# Altium schematic sheet power-supply.SchDoc
size A4; SheetNumber: 2; SheetTotal: 6
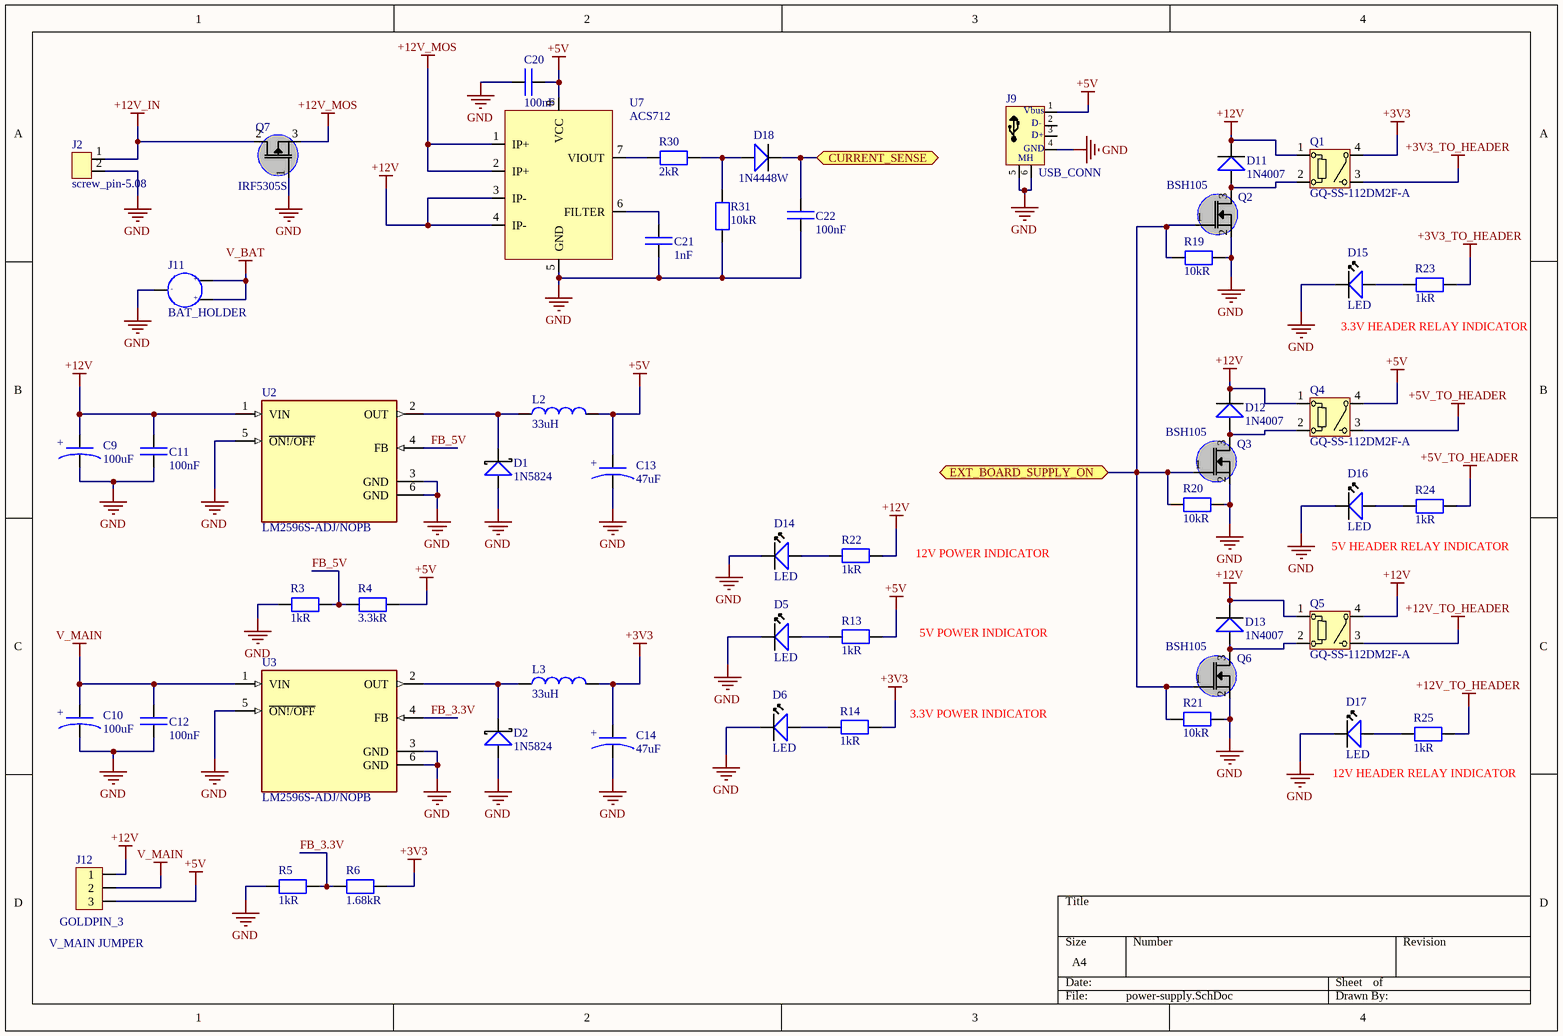
[diagram p0: power-supply.SchDoc]

## Parts
C9  100uF  [C_Pol_6.3x7.7]
C10  100uF  [C_Pol_6.3x7.7]
C11  100nF  [C0603]
C12  100nF  [C0603]
C13  47uF  [C_Pol_6.3x7.7]
C14  47uF  [C_Pol_6.3x7.7]
C20  100nF  [C0603]
C21  1nF  [C0603]
C22  100nF  [C0603]
D1  1N5824  [DO-214AA]
D2  1N5824  [DO-214AA]
D5  LED  [LED0805]
D6  LED  [LED0805]
D11  1N4007  [D_SMA]
D12  1N4007  [D_SMA]
D13  1N4007  [D_SMA]
D14  LED  [LED0805]
D15  LED  [LED0805]
D16  LED  [LED0805]
D17  LED  [LED0805]
D18  1N4448W  [SOD123F]
J2  screw_pin-5.08  [screw_pin-5.08]
J9  USB_CONN  [USB_A]
J11  BAT_HOLDER  [BAT_HOLDER]
J12  GOLDPIN_3  [PIN_HEADER_3_MALE]
L2  33uH  [SRR1260-330M]
L3  33uH  [SRR1260-330M]
Q1  GQ-SS-112DM2F-A  [GQ-SS-112DM2F-a]
Q2  BSH105  [SOT23]
Q3  BSH105  [SOT23]
Q4  GQ-SS-112DM2F-A  [GQ-SS-112DM2F-a]
Q5  GQ-SS-112DM2F-A  [GQ-SS-112DM2F-a]
Q6  BSH105  [SOT23]
Q7  IRF5305S  [DDPAK]
R3  1kR  [R0603]
R4  3.3kR  [R0603]
R5  1kR  [R0603]
R6  1.68kR  [R0603]
R13  1kR  [R0603]
R14  1kR  [R0603]
R19  10kR  [R0805]
R20  10kR  [R0805]
R21  10kR  [R0805]
R22  1kR  [R0603]
R23  1kR  [R0603]
R24  1kR  [R0603]
R25  1kR  [R0603]
R30  2kR  [R0603]
R31  10kR  [R0603]
U2  LM2596S-ADJ/NOPB  [TO-263]
U3  LM2596S-ADJ/NOPB  [TO-263]
U7  ACS712  [SOIC-8]

## Ports
CURRENT_SENSE (bidir), EXT_BOARD_SUPPLY_ON (bidir)

## Nets
+3V3: C14.1 L3.2 Q1.4 R6.2 R14.2
+3V3_TO_HEADER: Q1.3 R23.2
+5V: C13.1 C20.1 J9.1 J12.3 L2.2 Q4.4 R4.2 R13.2 U7.8(VCC)
+5V_TO_HEADER: Q4.3 R24.2
+12V: C9.1 C11.2 D11.K D12.K D13.K J12.1 Q1.1 Q4.1 Q5.1 Q5.4 R22.2 U2.1(VIN) U7.3(IP-) U7.4(IP-)
+12V_IN: J2.1 Q7.2
+12V_MOS: Q7.3 U7.1(IP+) U7.2(IP+)
+12V_TO_HEADER: Q5.3 R25.2
GND: C9.2 C10.2 C11.1 C12.1 C13.2 C14.2 C20.2 C21.1 C22.1 D1.A D2.A D5.K D6.K D14.K D15.K D16.K D17.K J2.2 J9.4 J9.5 J9.6 J11.3(-) Q2.2 Q3.2 Q6.2 Q7.1(G) R3.1 R5.1 R19.2 R20.2 R21.2 R31.1 U2.3(GND) U2.5(~{ON!/OFF}) U2.6(GND) U3.3(GND) U3.5(~{ON!/OFF}) U3.6(GND) U7.5(GND)
V_BAT: J11.1(+) J11.2(+)
V_MAIN: C10.1 C12.2 J12.2 U3.1(VIN)
CURRENT_SENSE: C22.2 D18.K ; port CURRENT_SENSE
EXT_BOARD_SUPPLY_ON: Q2.1(G) Q3.1(G) Q6.1(G) R19.1 R20.1 R21.1 ; port EXT_BOARD_SUPPLY_ON
FB_3.3V: R5.2 R6.1 U3.4(FB)
FB_5V: R3.2 R4.1 U2.4(FB)
NetC21_2: C21.2 U7.6(FILTER)
NetD1_K: D1.K L2.1 U2.2(OUT)
NetD2_K: D2.K L3.1 U3.2(OUT)
NetD5_A: D5.A R13.1
NetD6_A: D6.A R14.1
NetD11_A: D11.A Q1.2 Q2.3
NetD12_A: D12.A Q3.3 Q4.2
NetD13_A: D13.A Q5.2 Q6.3
NetD14_A: D14.A R22.1
NetD15_A: D15.A R23.1
NetD16_A: D16.A R24.1
NetD17_A: D17.A R25.1
NetD18_A: D18.A R30.1 R31.2
NetR30_2: R30.2 U7.7(VIOUT)

Not connected (* = marked no-connect by the designer): J9 2(D-) 3(D+)

## Notes on the sheet
- 3.3V HEADER RELAY INDICATOR
- (near R22) 12V POWER INDICATOR
- 5V HEADER RELAY INDICATOR
- (near R13) 5V POWER INDICATOR
- (near R14) 3.3V POWER INDICATOR
- 12V HEADER RELAY INDICATOR
- (near J12) V_MAIN JUMPER
- (in symbol Cap_SMD_elec) +
- (in symbol USB_CONN) Vbus; GND; MH

## Library data of the parts
C9 C10 C13 C14 = Cap_SMD_elec
C11 C12 C20-C22 = Cap_SMD
D1 D2 = Schottky_diode
D11-D13 D18 = Diode
L2 L3 = Inductor
Q2 Q3 Q6 = MOSFET_N
R3-R6 R13 R14 R19-R25 R30 R31 = Res
U2 U3 = LM2596S-ADJ/NOPB: SIMPLE SWITCHER&reg; 4.5V to 40V, 3A Low Component Count Step-Down Regulator 5-DDPAK/TO-263 -40 to 125; MF: Texas Instruments; MP: LM2596S-ADJ/NOPB; Price: None; Availability: Unavailable; SnapEDA_Link: https://www.snapeda.com/parts/LM2596S-ADJ/NOPB/Texas%20Instruments/view-part/276908/?ref=snap; Texas_Instruments-Purchase-URL: https://snapeda.com/shop?store=Texas+Instruments&id=276908; Value: *; Mouser-Purchase-URL: https://snapeda.com/shop?store=Mouser&id=276908; Package: TO-263-5 Texas Instruments; DigiKey-Purchase-URL: https://snapeda.com/shop?store=DigiKey&id=276908